# EAGLE design ModWheelsF19PCB (EAGLE 9.5.0)
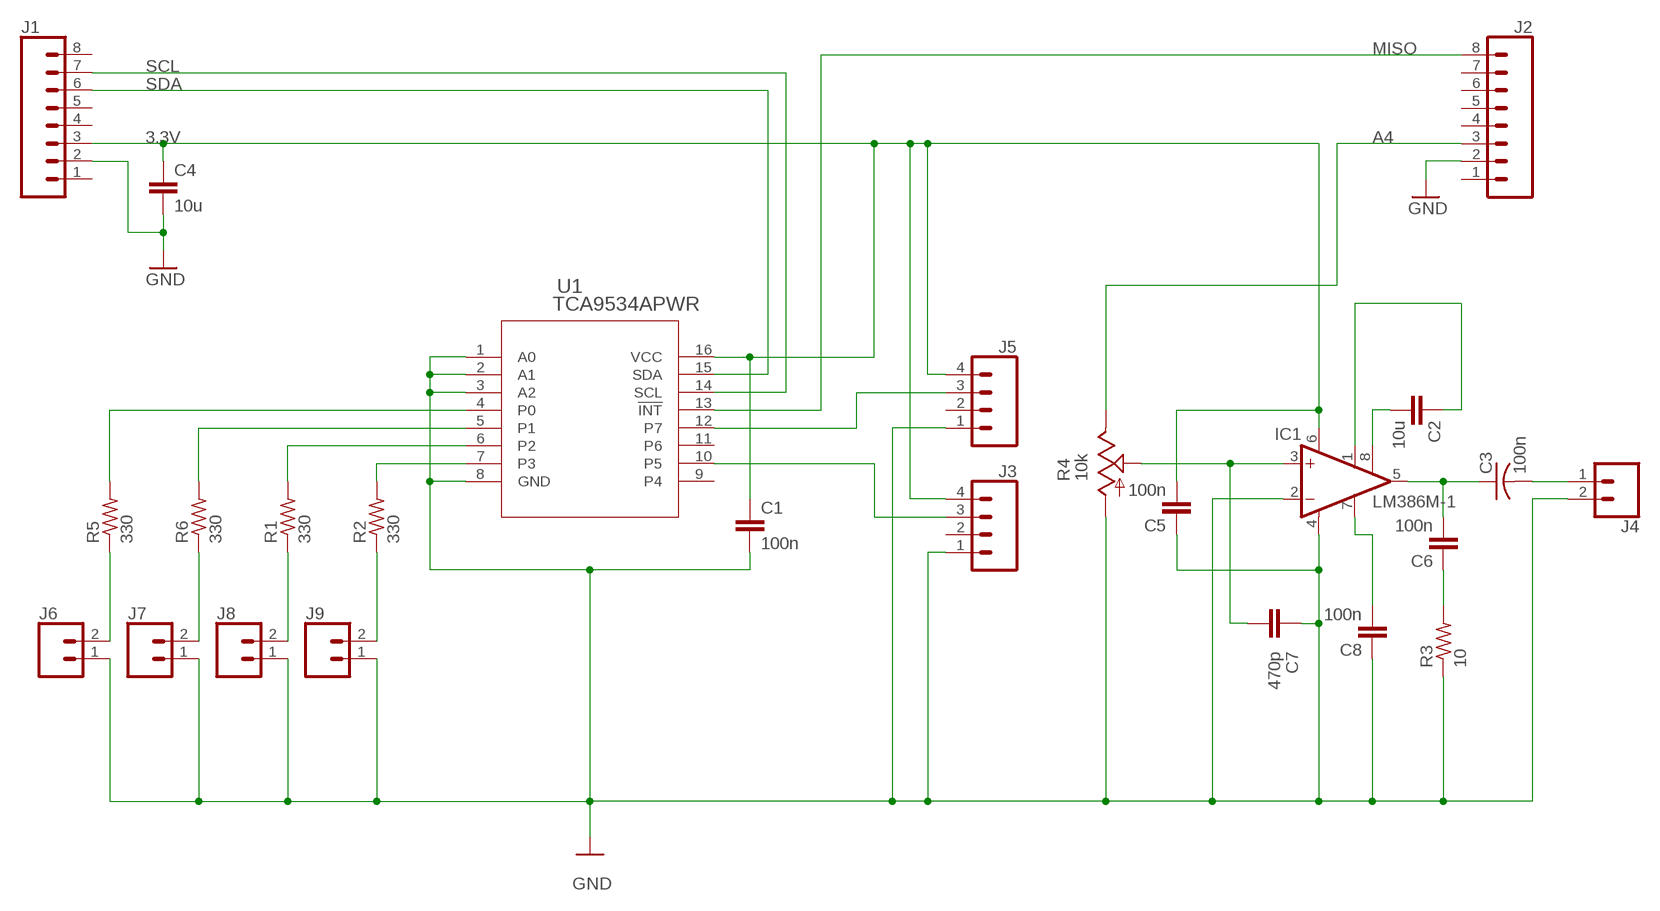
[diagram p0: schematic, sheet 1]

## Parts
C1  100n  C-EUC0805  [C0805]
C2  10u  C-EUC0805  [C0805]
C3  100n  C-USC0805  [C0805]
C4  10u  C-EUC0805  [C0805]
C5  100n  C-EUC0805  [C0805]
C6  100n  C-EUC0805  [C0805]
C7  470p  C-EUC0805  [C0805]
C8  100n  C-EUC0805  [C0805]
IC1  LM386M-1  [SO08]
J1  CONN_08"  [1X08]
J2  CONN_08"  [1X08]
J3  CONN_04PTH  [1X04]
J4  CONN_02  [1X02]
J5  CONN_04PTH  [1X04]
J6  CONN_02  [1X02]
J7  CONN_02  [1X02]
J8  CONN_02  [1X02]
J9  CONN_02  [1X02]
R1  330  R-US_R0805  [R0805]
R2  330  R-US_R0805  [R0805]
R3  10  R-US_R0805  [R0805]
R4  10k  TRIM_US-S75P  [S75P]
R5  330  R-US_R0805  [R0805]
R6  330  R-US_R0805  [R0805]
U1  TCA9534APWR  [PW16]

## Nets
3.3V: C1.1 C4.1 C5.2 IC1.6(VS) J1.3 J3.4 J5.4 U1.16(VCC)
A4: J2.3 R4.E
GND: C1.2 C4.2 C5.1 C7.1 C8.1 IC1.2(-IN) IC1.4(GND) J1.2 J2.2 J3.1 J4.2 J5.1 J6.1 J7.1 J8.1 J9.1 R3.1 R4.A U1.1(A0) U1.2(A1) U1.3(A2) U1.8(GND)
MISO: J2.8 U1.13(!INT)
N$1: C7.2 IC1.3(+IN) R4.S
N$2: J6.2 R5.1
N$3: J9.2 R2.1
N$4: J8.2 R1.1
N$5: R6.2 U1.5(P1)
N$6: R2.2 U1.7(P3)
N$7: C3.1 C6.2 IC1.5(OUT)
N$8: C6.1 R3.2
N$9: C2.2 IC1.8(GAIN)
N$11: C2.1 IC1.1(GAIN)
N$12: J7.2 R6.1
N$13: R1.2 U1.6(P2)
N$14: R5.2 U1.4(P0)
N$15: C8.2 IC1.7(BYPASS)
N$17: J3.3 U1.10(P5)
N$18: J5.3 U1.12(P7)
SCL: J1.7 U1.14(SCL)
SDA: J1.6 U1.15(SDA)
SPEAKER: C3.2 J4.1
Unconnected: J1.1 J1.4 J1.5 J1.8 J2.1 J2.4 J2.5 J2.6 J2.7 J3.2 J5.2 U1.9(P4) U1.11(P6)

## Library data of the parts
C1 C2 C4-C8 = rcl:C-EU: CAPACITOR, European symbol; SPICEPREFIX: C
C3 = rcl:C-US: CAPACITOR, American symbol; SPICEPREFIX: C
IC1 = linear:LM386?-*: Low Voltage Audio Power Amplifier Source: http://cache.national.com/ds/LM/LM386.pdf
J1 J2 = SparkFun-Connectors:CONN_08: Multi connection point. Often used as Generic Header-pin footprint for 0.1 inch spaced/style header connections On any of the 0.1 inch spaced packages, you can populate with these: Break Away Headers - Straight <https://www.sparkfun.com/products/116> (PRT-00116) Break Away Male Headers - Right Angle <https://www.sparkfun.com/products/553> (PRT-00553) Female Headers <https://www.sparkfun.com/products/115> (PRT-00115) Break Away Headers - Machine Pin <https://www.sparkfun.com/products/117> (PRT-00117) Break Away Female Headers - Swiss Machine Pin <https://www.sparkfun.com/products/743> (PRT-00743) Arduino Stackable Header - 8 Pin <https://www.sparkfun.com/products/9279> (PRT-09279) For SCREWTERMINALS and SPRING TERMINALS visit here: Screw Terimnals on SparkFun.com <https://www.sparkfun.com/search/results?term=Screw+Terminals> (5mm/3.5mm/2.54mm spacing) This device is also useful as a general connection point to wire up your design to another part of your project. Our various solder wires solder well into these plated through hole pads. Hook-Up Wire - Assortment (Stranded, 22 AWG) <https://www.sparkfun.com/products/11375> (PRT-11375) Hook-Up Wire - Assortment (Solid Core, 22 AWG) <https://www.sparkfun.com/products/11367> (PRT-11367) View the entire wire category on our website here <https://www.sparkfun.com/categories/141> Special notes: Molex polarized connector foot print use with SKU : PRT-08231 with associated crimp pins and housings. 1MM SMD Version SKU: PRT-10208 NOTES ON THE VARIANTS LOCK and LOCK_LONGPADS... This footprint was designed to help hold the alignment of a through-hole component (i.e. 6-pin header) while soldering it into place. You may notice that each hole has been shifted either up or down by 0.005 of an inch from it's more standard position (which is a perfectly straight line). This slight alteration caused the pins (the squares in the middle) to touch the edges of the holes. Because they are alternating, it causes a "brace" to hold the component in place. 0.005 has proven to be the perfect amount of "off-center" position when using our standard breakaway headers. Although looks a little odd when you look at the bare footprint, once you have a header in there, the alteration is very hard to notice. Also,if you push a header all the way into place, it is covered up entirely on the bottom side.; PROD_ID: CONN-08438
J3 J5 = SparkFun-Connectors:CONN_04: Multi connection point. Often used as Generic Header-pin footprint for 0.1 inch spaced/style header connections On any of the 0.1 inch spaced packages, you can populate with these: Break Away Headers - Straight <https://www.sparkfun.com/products/116> (PRT-00116) Break Away Male Headers - Right Angle <https://www.sparkfun.com/products/553> (PRT-00553) Female Headers <https://www.sparkfun.com/products/115> (PRT-00115) Break Away Headers - Machine Pin <https://www.sparkfun.com/products/117> (PRT-00117) Break Away Female Headers - Swiss Machine Pin <https://www.sparkfun.com/products/743> (PRT-00743) For SCREWTERMINALS and SPRING TERMINALS visit here: Screw Terimnals on SparkFun.com <https://www.sparkfun.com/search/results?term=Screw+Terminals> (5mm/3.5mm/2.54mm spacing) This device is also useful as a general connection point to wire up your design to another part of your project. Our various solder wires solder well into these plated through hole pads. Hook-Up Wire - Assortment (Stranded, 22 AWG) <https://www.sparkfun.com/products/11375> (PRT-11375) Hook-Up Wire - Assortment (Solid Core, 22 AWG) <https://www.sparkfun.com/products/11367> (PRT-11367) View the entire wire category on our website here <https://www.sparkfun.com/categories/141> Special notes: Molex polarized connector foot print use with SKU : PRT-08231 with associated crimp pins and housings. 1MM SMD Version SKU: PRT-10208; PROD_ID: CONN-09696
J4 J6-J9 = SparkFun-Connectors:CONN_02: Multi connection point. Often used as Generic Header-pin footprint for 0.1 inch spaced/style header connections On any of the 0.1 inch spaced packages, you can populate with these: Break Away Headers - Straight <https://www.sparkfun.com/products/116> (PRT-00116) Break Away Male Headers - Right Angle <https://www.sparkfun.com/products/553> (PRT-00553) Female Headers <https://www.sparkfun.com/products/115> (PRT-00115) Break Away Headers - Machine Pin <https://www.sparkfun.com/products/117> (PRT-00117) Break Away Female Headers - Swiss Machine Pin <https://www.sparkfun.com/products/743> (PRT-00743) For SCREWTERMINALS and SPRING TERMINALS visit here: Screw Terimnals on SparkFun.com <https://www.sparkfun.com/search/results?term=Screw+Terminals> (5mm/3.5mm/2.54mm spacing) This device is also useful as a general connection point to wire up your design to another part of your project. Our various solder wires solder well into these plated through hole pads. Hook-Up Wire - Assortment (Stranded, 22 AWG) <https://www.sparkfun.com/products/11375> (PRT-11375) Hook-Up Wire - Assortment (Solid Core, 22 AWG) <https://www.sparkfun.com/products/11367> (PRT-11367) View the entire wire category on our website here <https://www.sparkfun.com/categories/141> Special notes: Molex polarized connector foot print use with: PRT-08233 with associated crimp pins and housings. 2.54_SCREWTERM for use with PRT-10571. 3.5mm Screw Terminal footprints for PRT-08084 5mm Screw Terminal footprints for use with PRT-08432
R1-R3 R5 R6 = rcl:R-US_: RESISTOR, American symbol; SPICEPREFIX: R
R4 = pot:TRIM_US-: POTENTIOMETER
U1 = TCA9534:TCA9534APWR; MANUFACTURER_PART_NUMBER: TCA9534APWR; VENDOR: Texas Instruments

## Board
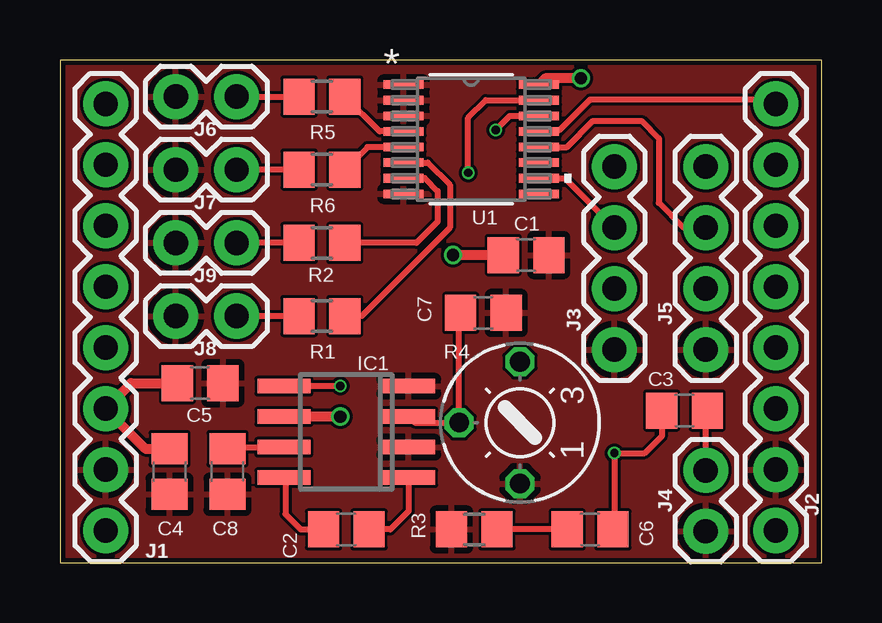
[diagram p1: board, top side]
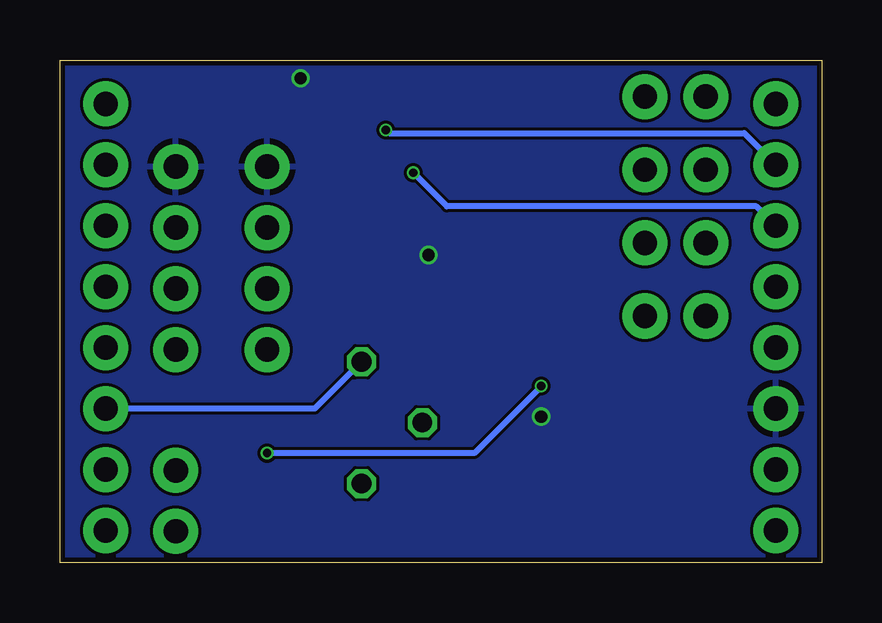
[diagram p2: board, bottom side, seen from below]

Size 31.75 x 20.95 mm. Coordinates in mm from the lower left corner, seen from the top.
Outline: 0,0 31.75,0 31.75,20.95 0,20.95 0,0
Copper layers (1*16): Top 0.035559375mm / dielectric 1.6mm / Bottom 0.035559375mm
Design rules "jlcpcb2layer *": minimum track width 8mil, minimum drill 12mil, track to track 5mil, track to pad 5mil, pad to pad 5mil, via to via 5mil, smd to smd 5mil, copper to edge 8mil, drill to drill 6mil, minimum pad ring 5mil, minimum via ring 3mil, stop-mask expansion 2.5mil, vias tented up to drill 0mil, thermal gap 10mil

### Footprints (pad centres in the part's own frame; a part is rotated, then mirrored left to right if it is on the bottom)
C0805 = smd 1.3 x 1.5: 1 -0.95,0; 2 0.95,0
SO08 = smd 0.6 x 2.2: 1 -1.905,-2.6; 2 -0.635,-2.6; 3 0.635,-2.6; 4 1.905,-2.6; 5 1.905,2.6; 6 0.635,2.6; 7 -0.635,2.6; 8 -1.905,2.6
1X08 = drill 1.016 pad 1.88: 1 0,0; 2 2.54,0; 3 5.08,0; 4 7.62,0; 5 10.16,0; 6 12.7,0; 7 15.24,0; 8 17.78,0
1X04 = drill 1.016 pad 1.88: 1 0,0; 2 2.54,0; 3 5.08,0; 4 7.62,0
1X02 = drill 1.016 pad 1.88: 1 0,0; 2 2.54,0
R0805 = smd 1.3 x 1.5: 1 -0.95,0; 2 0.95,0
S75P = drill 0.813 octagon: A -2.54,0; E 2.54,0; S 0,2.54
PW16 = smd 1.676 x 0.356: 1 -2.819,2.275; 2 -2.819,1.625; 3 -2.819,0.975; 4 -2.819,0.325; 5 -2.819,-0.325; 6 -2.819,-0.975; 7 -2.819,-1.625; 8 -2.819,-2.275; 9 2.819,-2.275; 10 2.819,-1.625; 11 2.819,-0.975; 12 2.819,-0.325; 13 2.819,0.325; 14 2.819,0.975; 15 2.819,1.625; 16 2.819,2.275

### Placement (x,y rotation side)
C1  19.43,12.83 0 top
C2  11.94,1.4 180 top
C3  26.04,6.35 0 top
C4  4.57,3.81 270 top
C5  5.84,7.49 180 top
C6  22.1,1.4 0 top
C7  17.65,10.41 180 top
C8  6.99,3.81 90 top
IC1  11.94,5.46 90 top
J1  1.91,1.35 90 top
J2  29.84,1.35 90 top
J3  23.11,8.89 90 top
J4  26.92,3.86 270 top
J5  26.92,8.89 90 top
J6  4.83,19.43 0 top
J7  4.83,16.38 0 top
J8  4.83,10.29 0 top
J9  4.83,13.34 0 top
R1  10.92,10.29 0 top
R2  10.92,13.34 0 top
R3  17.27,1.4 0 top
R4  19.18,5.84 90 top
R5  10.92,19.43 0 top
R6  10.92,16.38 0 top
U1  17.14,17.65 0 top

### Tracks (layer width: path | path; a pad name or v marks a point on that pad's centre or on a via)
3.3V  (via drill 0.51)
  Top 0.406: v21.72,20.19 20.23,20.19 U1.16 | v11.68,6.1 IC1.6 | C4.1 3.56,4.76 1.91,6.41 J1.3 2.97,7.49 C5.2 | C1.1 v16.38,12.83
  pour Bottom: 0,21.08 31.75,21.08 31.75,0 0,0
A4
  Bottom 0.254: R4.E 21.13,6.43 J2.3
GND
  pour Top: 0,21.08 31.75,21.08 31.75,0 0,0
MISO
  Top 0.254: J2.8 29.67,19.3 22.1,19.3 20.83,18.03 20.02,18.03 U1.13
N$1
  Top 0.254: IC1.3 14.79,5.84 R4.S 16.64,10.35 C7.2
N$2
  Top 0.254: J6.2 R5.1
N$3
  Top 0.254: R2.1 J9.2
N$4
  Top 0.254: R1.1 J8.2
N$5
  Top 0.254: U1.5 12.82,17.33 R6.2
N$6
  Top 0.254: U1.7 15.21,16.03 15.75,15.49 15.75,14.22 14.86,13.34 R2.2
N$7  (via drill 0.35)
  Top 0.254: v11.68,7.37 IC1.5 | C6.2 23.11,1.46 v23.11,4.57 24.38,4.57 25.09,5.27 C3.1
  Bottom 0.254: v11.68,7.37 14.48,4.57 v23.11,4.57
N$8
  Top 0.254: C6.1 R3.2
N$9
  Top 0.254: IC1.8 9.4,3.5 9.4,2.03 10.03,1.4 C2.2
N$11
  Top 0.254: IC1.1 14.54,2.16 13.78,1.4 C2.1
N$12
  Top 0.254: R6.1 J7.2
N$13
  Top 0.254: U1.6 15.33,16.68 16.26,15.75 16.26,13.97 12.57,10.29 R1.2
N$14
  Top 0.254: U1.4 13.32,17.98 R5.2
N$15
  Top 0.254: C8.2 7.05,4.83 IC1.7
N$17
  Top 0.254: U1.10 21.06,16.03 J3.3
N$18
  Top 0.254: J5.3 26,13.97 24.97,15 24.97,17.7 24.26,18.41 22.23,18.41 21.14,17.33 U1.12
SCL  (via drill 0.35)
  Top 0.254: v18.16,18.03 18.75,18.63 U1.14
  Bottom 0.254: J1.7 3.22,17.91 18.03,17.91 v18.16,18.03
SDA  (via drill 0.35)
  Top 0.254: v17.02,16.26 17.02,18.54 17.75,19.28 U1.15
  Bottom 0.254: J1.6 2.71,14.86 15.62,14.86 v17.02,16.26
SPEAKER
  Top 0.254: J4.1 26.92,6.29 C3.2